# EAGLE design jlpcb-128 (EAGLE 5.11)
ABBREV: jn6; PROJECT: JeeNode v6
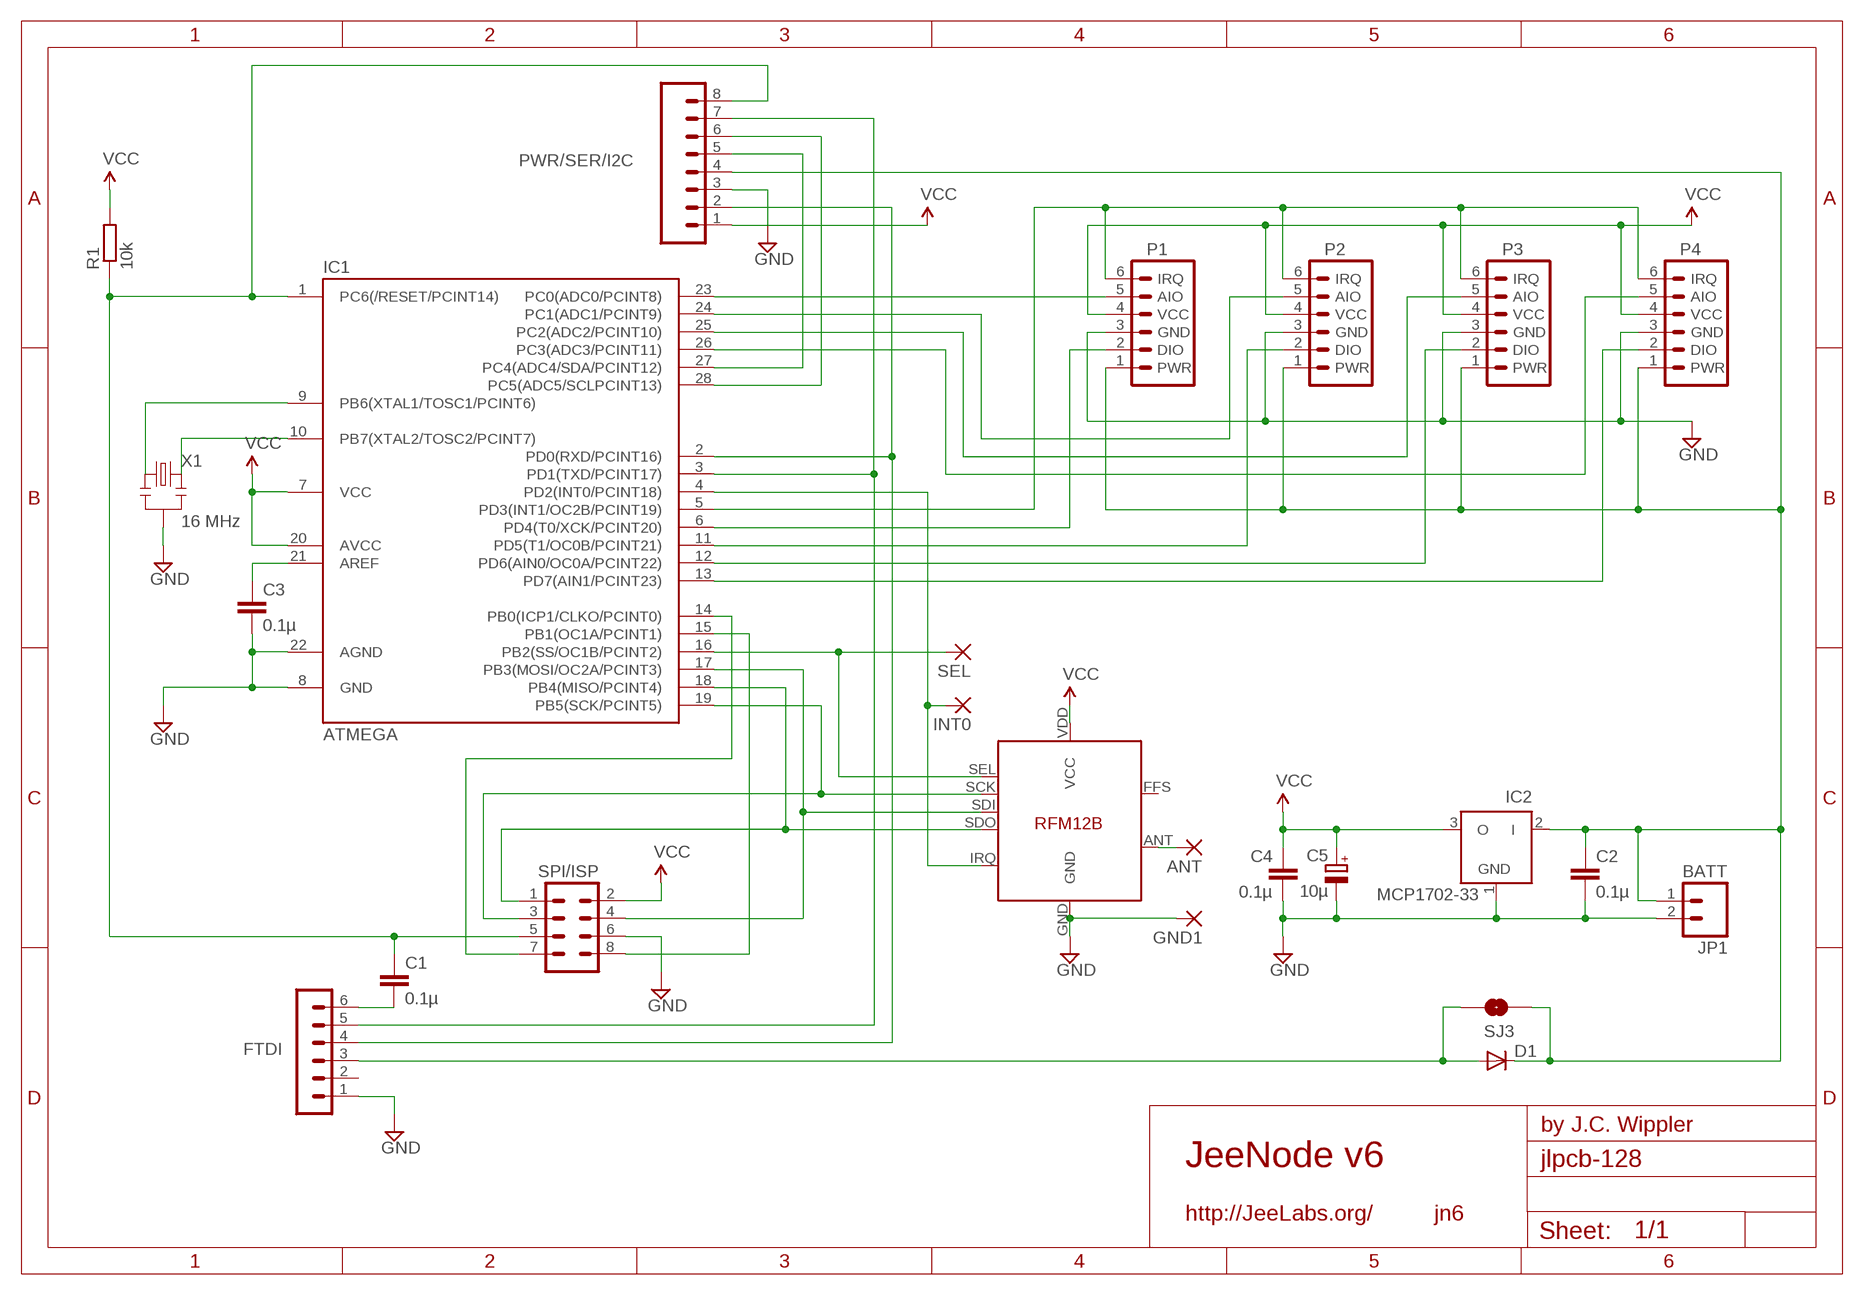
[diagram p0: schematic, sheet 1]

## Parts
ANT  1,6/0,8  [1,6/0,8]
C1  0.1µ  C-EU025-024X044  [C025-024X044]
C2  0.1µ  C-EU025-024X044  [C025-024X044]
C3  0.1µ  C-EU025-024X044  [C025-024X044]
C4  0.1µ  C-EU025-024X044  [C025-024X044]
C5  10µ  CPOL-EUE1.8-4  [E1,8-4]
D1  DIODE-D-5  [D-5]
FTDI  FTDI  MA06-1  [MA06-1]
GND1  1,6/0,8  [1,6/0,8]
IC1  ATMEGA  ATMEGA48/88/168-PU  [DIL28-3]
IC2  MCP1702-33  MCP1702Z  [TO92]
INT0  1,6/0,8  [1,6/0,8]
JP1  BATT  M02LOCK_LONGPADS  [1X02_LOCK_LONGPADS]
P1  JEEPORT  JEEPORT-FEMALE  [1X06_FEMALE_LOCK.010]
P2  JEEPORT  JEEPORT-FEMALE  [1X06_FEMALE_LOCK.010]
P3  JEEPORT  JEEPORT-FEMALE  [1X06_FEMALE_LOCK.010]
P4  JEEPORT  JEEPORT-FEMALE  [1X06_FEMALE_LOCK.010]
PWR/SER/I2C  M08  [1X08]
R1  10k  R-EU_0204/7  [0204/7]
SEL  1,6/0,8  [1,6/0,8]
SJ3  SOLDERJUMPERTRACE  [SJ_2S-TRACE]
SV7  SPI/ISP  MA04-2  [MA04-2]
U$1  RFM12B  [RFM12B]
X1  16 MHz  RESONATORPTH  [RESONATOR-PTH]

## Nets
A0: IC1.23(PC0(ADC0/PCINT8)) P1.5(AIO)
A1: IC1.24(PC1(ADC1/PCINT9)) P2.5(AIO)
A2: IC1.25(PC2(ADC2/PCINT10)) P3.5(AIO)
A3: IC1.26(PC3(ADC3/PCINT11)) P4.5(AIO)
GND [power]: C2.2 C3.2 C4.2 C5.- FTDI.1 GND1.1(P) IC1.8(GND) IC1.22(AGND) IC2.1(GND) JP1.2 P1.3(GND) P2.3(GND) P3.3(GND) P4.3(GND) PWR/SER/I2C.3 SV7.6 U$1.GND X1.2
INT2: IC1.5(PD3(INT1/OC2B/PCINT19)) P1.6(IRQ) P2.6(IRQ) P3.6(IRQ) P4.6(IRQ)
N$1: IC1.9(PB6(XTAL1/TOSC1/PCINT6)) X1.1
N$2: IC1.18(PB4(MISO/PCINT4)) SV7.1 U$1.SDO
N$3: IC1.17(PB3(MOSI/OC2A/PCINT3)) SV7.4 U$1.SDI
N$4: IC1.16(PB2(SS/OC1B/PCINT2)) SEL.1(P) U$1.SEL
N$5: IC1.19(PB5(SCK/PCINT5)) SV7.3 U$1.SCK
N$6: IC1.15(PB1(OC1A/PCINT1)) SV7.8
N$7: IC1.4(PD2(INT0/PCINT18)) INT0.1(P) U$1.IRQ
N$8: IC1.6(PD4(T0/XCK/PCINT20)) P1.2(DIO)
N$9: IC1.11(PD5(T1/OC0B/PCINT21)) P2.2(DIO)
N$10: IC1.12(PD6(AIN0/OC0A/PCINT22)) P3.2(DIO)
N$11: IC1.13(PD7(AIN1/PCINT23)) P4.2(DIO)
N$12 [power]: D1.A FTDI.3 SJ3.2
N$13: ANT.1(P) U$1.ANT
N$19: C3.1 IC1.21(AREF)
N$20: C1.2 FTDI.6
N$21: IC1.10(PB7(XTAL2/TOSC2/PCINT7)) X1.3
N$22: IC1.14(PB0(ICP1/CLKO/PCINT0)) SV7.7
N$24: IC1.28(PC5(ADC5/SCLPCINT13)) PWR/SER/I2C.6
N$25: IC1.27(PC4(ADC4/SDA/PCINT12)) PWR/SER/I2C.5
PWR [power]: C2.1 D1.C IC2.2(I) JP1.1 P1.1(PWR) P2.1(PWR) P3.1(PWR) P4.1(PWR) PWR/SER/I2C.4 SJ3.1
RST: C1.1 IC1.1(PC6(/RESET/PCINT14)) PWR/SER/I2C.8 R1.1 SV7.5
RXD: FTDI.4 IC1.2(PD0(RXD/PCINT16)) PWR/SER/I2C.2
TXD: FTDI.5 IC1.3(PD1(TXD/PCINT17)) PWR/SER/I2C.7
VCC [power]: C4.1 C5.+ IC1.7(VCC) IC1.20(AVCC) IC2.3(O) P1.4(VCC) P2.4(VCC) P3.4(VCC) P4.4(VCC) PWR/SER/I2C.1 R1.2 SV7.2 U$1.VDD(VCC)
Unconnected: FTDI.2 U$1.FFS

## Library data of the parts
ANT GND1 INT0 SEL = JeeLabs:1,6/0,8: THROUGH-HOLE PAD
C1-C4 = resistor:C-EU: CAPACITOR, European symbol
C5 = resistor:CPOL-EU: POLARIZED CAPACITOR, European symbol
D1 = diode:DIODE-: DIODE
FTDI = JeeLabs:MA06-1: PIN HEADER
IC1 = atmega8:ATMEGA48/88/168-PU
IC2 = JeeLabs:MCP1702: 200 mA, Low Power Low Dropout Voltage Regulator
JP1 = SparkFun:M02: Header 2 Standard 2-pin 0.1" header. Use with straight break away headers (SKU : PRT-00116), right angle break away headers (PRT-00553), swiss pins (PRT-00743), machine pins (PRT-00117), and female headers (PRT-00115). Molex polarized connector foot print use with SKU : PRT-08233 with associated crimp pins and housings.
P1-P4 = JeeLabs:JEEPORT: PIN HEADER
PWR/SER/I2C = SparkFun:M08: Header 8 Standard 8-pin 0.1" header. Use with straight break away headers (SKU : PRT-00116), right angle break away headers (PRT-00553), swiss pins (PRT-00743), machine pins (PRT-00117), and female headers (PRT-00115).
R1 = resistor:R-EU_: RESISTOR, European symbol
SJ3 = SparkFun:SOLDERJUMPER: Solder Jumper Standard SMD solder jumper. Used to automate production. Two varients : Normally Open and Normally Closed are the same, but have different paste layers. NC will have a large amount of paste and should jumper during reflow.
SV7 = JeeLabs:MA04-2: PIN HEADER
U$1 = JeeLabs:RFM12B
X1 = SparkFun:RESONATOR: Resonator Small SMD resonator. This is the itty bitty 10/20MHz resonators with built in caps. CSTCE10M0G55 and CSTCE20M0V53. Footprint has been reviewed closely but hasn't been tested yet.

## Net classes
1 power: width 0.381 mm, clearance 0.254 mm

## Board
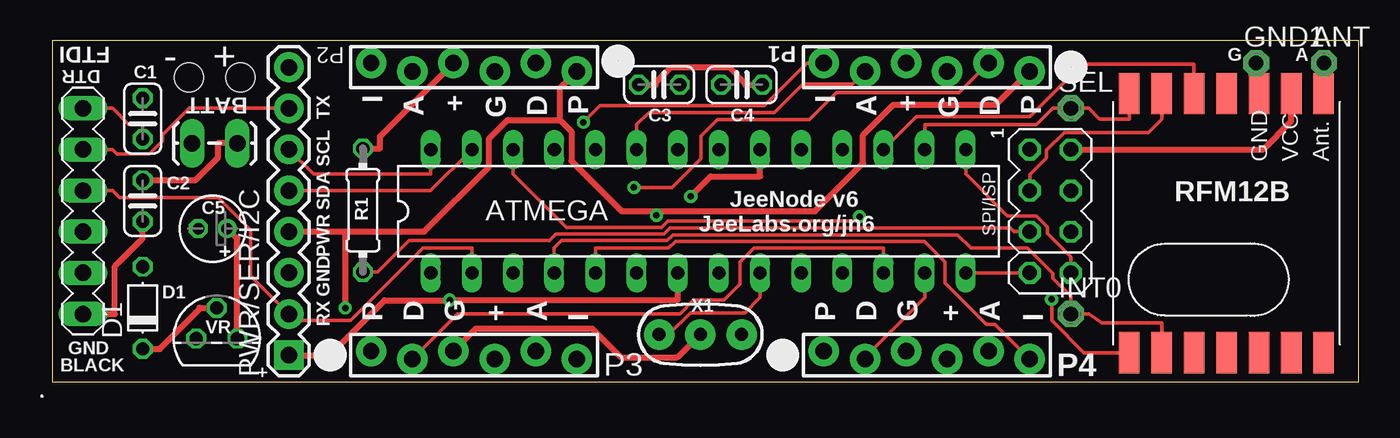
[diagram p1: board, top side]
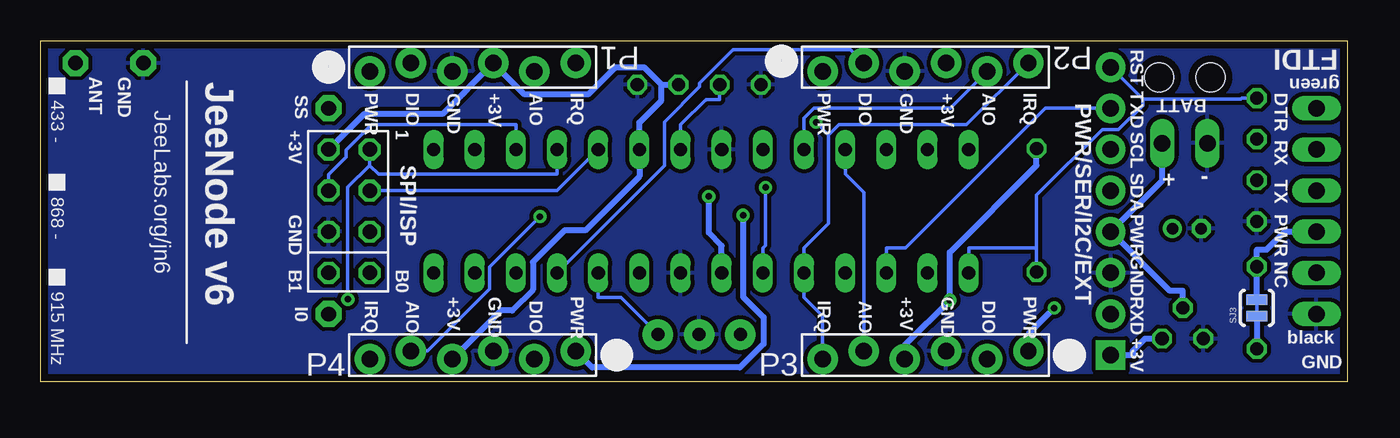
[diagram p2: board, bottom side, seen from below]

Size 80.64 x 21.08 mm. Coordinates in mm from the lower left corner, seen from the top.
Outline: 0,0 80.64,0 80.64,21.08 0,21.08 0,0
Copper layers (1*16): Top 0.035mm / dielectric 1.5mm / Bottom 0.035mm
Design rules "10mils *": minimum track width 8mil, minimum drill 0.4mm, track to track 8mil, track to pad 8mil, pad to pad 8mil, via to via 8mil, smd to smd 8mil, copper to edge 18mil, drill to drill 0.4mm, minimum pad ring 0.15mm, minimum via ring 8mil, stop-mask expansion 4mil, vias tented up to drill 20mil, thermal gap 10mil
Holes 1.78 mm at 8.45,18.8 11.62,18.8

### Footprints (pad centres in the part's own frame; a part is rotated, then mirrored left to right if it is on the bottom)
1,6/0,8 = drill 0.9 pad 1.6 octagon: 1 0,0
C025-024X044 = drill 0.813 octagon: 1 -1.27,0; 2 1.27,0
E1,8-4 = drill 0.711 pad 1.168 round: + -0.889,0 | drill 0.711 pad 1.168 octagon: - 0.889,0
D-5 = drill 0.813 octagon: A 2.54,0; C -2.54,0
MA06-1 = drill 1.016 long: 1 0,0; 2 2.54,0; 3 5.08,0; 4 7.62,0; 5 10.16,0; 6 12.7,0
DIL28-3 = drill 0.813 long: 1 -16.51,-3.81; 2 -13.97,-3.81; 3 -11.43,-3.81; 4 -8.89,-3.81; 5 -6.35,-3.81; 6 -3.81,-3.81; 7 -1.27,-3.81; 8 1.27,-3.81; 9 3.81,-3.81; 10 6.35,-3.81; 11 8.89,-3.81; 12 11.43,-3.81; 13 13.97,-3.81; 14 16.51,-3.81; 15 16.51,3.81; 16 13.97,3.81; 17 11.43,3.81; 18 8.89,3.81; 19 6.35,3.81; 20 3.81,3.81; 21 1.27,3.81; 22 -1.27,3.81; 23 -3.81,3.81; 24 -6.35,3.81; 25 -8.89,3.81; 26 -11.43,3.81; 27 -13.97,3.81; 28 -16.51,3.81
TO92 = drill 0.813 octagon: 1 -1.27,0; 2 0,1.905; 3 1.27,0
1X02_LOCK_LONGPADS = drill 1.016 long: 1 -0.127,0; 2 2.667,0
1X06_FEMALE_LOCK.010 = drill 1.016 pad 1.88 round: 1 0,0.254; 2 2.54,-0.254; 3 5.08,0.254; 4 7.62,-0.254; 5 10.16,0.254; 6 12.7,-0.254
1X08 = drill 1.016 pad 1.829 square: 1 0,0 | drill 1.016 pad 1.829 round: 2 2.54,0; 3 5.08,0; 4 7.62,0; 5 10.16,0; 6 12.7,0; 7 15.24,0; 8 17.78,0
0204/7 = drill 0.813 octagon: 1 -3.81,0; 2 3.81,0
SJ_2S-TRACE = smd 0.635 x 1.27: 1 -0.508,0; 2 0.508,0
MA04-2 = drill 0.9 octagon: 1 -3.81,-1.27; 2 -3.81,1.27; 3 -1.27,-1.27; 4 -1.27,1.27; 5 1.27,-1.27; 6 1.27,1.27; 7 3.81,-1.27; 8 3.81,1.27
RFM12B = smd 2.54 x 1.27: ANT 8,-6; FFS -8,2; GND 8,-2; IRQ -8,4; P$8 -8,0; P$9 -8,-2; P$10 -8,-4; P$12 -8,-6; P$16 8,0; SCK 8,4; SDI 8,2; SDO -8,6; SEL 8,6; VDD 8,-4
RESONATOR-PTH = drill 0.8 pad 1.88 round: 1 -2.54,0; 2 0,0; 3 2.54,0

### Placement (x,y rotation side)
ANT  78.49,19.69 0 top
C1  5.59,16.26 270 top
C2  5.59,11.18 270 top
C3  37.47,18.35 180 top
C4  42.55,18.35 0 top
C5  9.91,9.46 180 top
D1  5.59,4.57 90 top
FTDI  1.91,4.19 90 top
GND1  74.3,19.69 0 top
IC1  39.88,10.54 0 top
IC2  10.16,2.67 0 top
INT0  62.87,4.19 0 top
JP1  11.3,14.73 180 top
P1  60.33,19.43 180 top
P2  32.39,19.43 180 top
P3  19.68,1.65 0 top
P4  47.62,1.65 0 top
PWR/SER/I2C  14.61,1.65 90 top
R1  19.18,10.6 90 top
SEL  62.87,16.89 0 top
SJ3  5.59,4.57 90 bottom
SV7  61.59,10.54 270 top
U$1  72.47,9.8 90 top
X1  40.01,2.92 0 top

### Tracks (layer width: path | path; a pad name or v marks a point on that pad's centre or on a via)
A0
  Top 0.203: P1.5 49.38,18.39 46.33,18.39 44.57,16.63 36.83,16.63 36.07,15.88 IC1.23
A1
  Bottom 0.203: P2.5 24.49,16.91 32.91,16.91 33.53,16.3 33.53,15.88 IC1.24
A2
  Bottom 0.203: IC1.25 30.99,12.83 29.84,11.68 P3.5
A3  (via drill 0.4 pad 0.81)
  Top 0.203: v49.82,10.2 49.56,9.93 38,9.93 37.6,9.53 31.75,9.53 28.45,12.83 IC1.26
  Bottom 0.203: P4.5 56.77,1.91 52.93,5.74 52.93,7.09 v49.82,10.2
GND
  Top 0.381: C4.2 42.76,18.35 42.76,18.46 41.8,19.43 38.19,19.43 37.25,18.48 37.25,18.35 C3.2 | X1.2 38.6,1.52 35.11,1.52 33.33,3.3 26.16,3.3 P3.3 | C2.2 5.59,8.85 3.87,7.14 3.87,4.19 FTDI.1 | U$1.GND 74.47,19.52 74.46,19.52 GND1.1
  pour Bottom: 0,21.08 80.64,21.08 80.64,0 0,0
INT2  (via drill 0.4 pad 0.81)
  Top 0.203: v32.79,16.04 33.82,17.07 43.95,17.07 46.57,19.69 P1.6 | P4.6 58.17,3.55 57.66,3.55 55.08,6.12 55.08,7.4 53.82,8.66 38.46,8.66 38.05,8.26 33.53,8.26 IC1.5
  Bottom 0.203: 32.01,15.25 32.01,9.77 33.53,8.26 IC1.5 33.53,6.27 33.53,5.21 32.39,4.06 P3.6 | P2.6 23.49,15.88 31.39,15.88 32.01,15.25 | 32.01,15.25 v32.79,16.04
N$1
  Top 0.203: IC1.9 43.69,5.21 42.74,4.26 39.38,4.26 38.04,2.92 X1.1
N$2  (via drill 0.4 pad 0.81)
  Top 0.203: U$1.SDO 63.66,1.8 61.68,3.79 v61.68,5.1
  Bottom 0.203: v61.68,5.1 61.68,12.02 60.33,13.37 | 60.33,13.37 59.78,12.83 48.77,12.83 IC1.18 | 60.33,13.37 SV7.1
N$3
  Top 0.203: U$1.SDI 70.47,19.63 63.58,19.63 60.34,16.39 53.35,16.39 IC1.17
  Bottom 0.203: SV7.4 62.87,12.79 61.77,13.88 61.77,14.3 60.2,15.88 51.31,15.88 IC1.17
N$4
  Top 0.203: U$1.SEL 66.47,16.23 64.63,16.23 63.97,16.89 SEL.1 61.76,16.89 60.74,15.88 53.85,15.88 IC1.16
N$5
  Top 0.203: SV7.3 60.33,12.79 61.36,13.83 61.36,14.31 62.46,15.4 67.64,15.4 68.47,16.23 U$1.SCK
  Bottom 0.203: SV7.3 48.77,11.81 IC1.19
N$6
  Top 0.203: IC1.15 56.39,12.83 58.96,10.25 60.73,10.25 61.43,9.56 61.43,9.15 62.87,7.71 SV7.8
N$7
  Top 0.203: U$1.IRQ 68.47,3.63 64.78,3.63 63.97,4.19 INT0.1 62.87,5.3 61.76,6.4 61.76,6.69 60.2,8.26 56.7,8.26 55.87,9.08 38.3,9.08 37.94,8.72 31.45,8.72 30.99,8.26 IC1.4
N$8  (via drill 0.4 pad 0.81)
  Top 0.203: P1.2 55.96,17.86 48.39,17.86 46.72,16.19 41.07,16.19 40.05,15.18 40.05,13.8 38.26,12.01 v35.9,12.01
  Bottom 0.203: IC1.6 36.07,8.26 35.9,8.42 v35.9,12.01
N$9
  Bottom 0.203: P2.2 30.67,20.51 37.9,20.51 39.97,18.44 39.97,18.23 42.15,16.05 42.15,13.35 IC1.11
N$10
  Top 0.203: IC1.12 51.31,8.26 43.31,8.26 42.45,7.4 42.45,6.04 41.46,5.05 39.59,5.05 38.75,4.21 25.03,4.21 P3.2
N$11
  Top 0.203: IC1.13 53.85,5.21 50.16,1.52 P4.2
N$12
  Bottom 0.381: SJ3.2 D1.A 5.59,8.17 4.98,8.17 3.87,9.27 FTDI.3
N$13
  Top 0.203: U$1.ANT 78.47,19.38 78.49,19.4 ANT.1
N$14
  Top 0.005: -0.61,-0.94 arc10 -0.61,-0.93 | -0.61,-0.93 -0.59,-0.95 | -0.59,-0.95 -0.57,-0.94 | -0.57,-0.94 -0.59,-0.92 | -0.59,-0.92 arc19 -0.58,-0.9 | -0.58,-0.9 -0.56,-0.9 | -0.56,-0.9 -0.56,-0.88 | -0.56,-0.88 -0.58,-0.88 | -0.58,-0.88 arc19 -0.59,-0.86 | -0.59,-0.86 -0.57,-0.84 | -0.57,-0.84 -0.59,-0.83 | -0.59,-0.83 -0.61,-0.84 | -0.61,-0.84 arc19 -0.62,-0.84 | -0.62,-0.84 -0.63,-0.81 | -0.63,-0.81 -0.64,-0.81 | -0.64,-0.81 -0.65,-0.84 | -0.66,-0.84 arc-19 -0.65,-0.84 | -0.68,-0.83 -0.66,-0.84 | -0.7,-0.84 -0.68,-0.83 | -0.68,-0.86 -0.7,-0.84 | -0.69,-0.88 arc-19 -0.68,-0.86 | -0.71,-0.88 -0.69,-0.88 | -0.71,-0.9 -0.71,-0.88 | -0.69,-0.9 -0.71,-0.9 | -0.68,-0.92 arc-19 -0.69,-0.9 | -0.7,-0.94 -0.68,-0.92 | -0.68,-0.95 -0.7,-0.94 | -0.66,-0.93 -0.68,-0.95 | -0.66,-0.94 arc-10 -0.66,-0.93 | -0.64,-0.91 -0.66,-0.94 | -0.66,-0.89 arc68 -0.64,-0.91 | -0.63,-0.91 arc248 -0.66,-0.89 | -0.61,-0.94 -0.63,-0.91 | -0.61,-0.94 arc10 -0.61,-0.93 | -0.61,-0.93 -0.59,-0.95 | -0.59,-0.95 -0.57,-0.94 | -0.57,-0.94 -0.59,-0.92 | -0.59,-0.92 arc19 -0.58,-0.9 | -0.58,-0.9 -0.56,-0.9 | -0.56,-0.9 -0.56,-0.88 | -0.56,-0.88 -0.58,-0.88 | -0.58,-0.88 arc19 -0.59,-0.86 | -0.59,-0.86 -0.57,-0.84 | -0.57,-0.84 -0.59,-0.83 | -0.59,-0.83 -0.61,-0.84 | -0.61,-0.84 arc19 -0.62,-0.84 | -0.62,-0.84 -0.63,-0.81 | -0.63,-0.81 -0.64,-0.81 | -0.64,-0.81 -0.65,-0.84 | -0.66,-0.84 arc-19 -0.65,-0.84 | -0.68,-0.83 -0.66,-0.84 | -0.7,-0.84 -0.68,-0.83 | -0.68,-0.86 -0.7,-0.84 | -0.69,-0.88 arc-19 -0.68,-0.86 | -0.71,-0.88 -0.69,-0.88 | -0.71,-0.9 -0.71,-0.88 | -0.69,-0.9 -0.71,-0.9 | -0.68,-0.92 arc-19 -0.69,-0.9 | -0.7,-0.94 -0.68,-0.92 | -0.68,-0.95 -0.7,-0.94 | -0.66,-0.93 -0.68,-0.95 | -0.66,-0.94 arc-10 -0.66,-0.93
  Top 0.005: -0.64,-0.91 -0.66,-0.94 | -0.66,-0.89 arc68 -0.64,-0.91 | -0.63,-0.91 arc248 -0.66,-0.89 | -0.61,-0.94 -0.63,-0.91 | -0.61,-0.94 arc10 -0.61,-0.93 | -0.61,-0.93 -0.59,-0.95 | -0.59,-0.95 -0.57,-0.94 | -0.57,-0.94 -0.59,-0.92 | -0.59,-0.92 arc19 -0.58,-0.9 | -0.58,-0.9 -0.56,-0.9 | -0.56,-0.9 -0.56,-0.88 | -0.56,-0.88 -0.58,-0.88 | -0.58,-0.88 arc19 -0.59,-0.86 | -0.59,-0.86 -0.57,-0.84 | -0.57,-0.84 -0.59,-0.83 | -0.59,-0.83 -0.61,-0.84 | -0.61,-0.84 arc19 -0.62,-0.84 | -0.62,-0.84 -0.63,-0.81 | -0.63,-0.81 -0.64,-0.81 | -0.64,-0.81 -0.65,-0.84 | -0.66,-0.84 arc-19 -0.65,-0.84 | -0.68,-0.83 -0.66,-0.84 | -0.7,-0.84 -0.68,-0.83 | -0.68,-0.86 -0.7,-0.84 | -0.69,-0.88 arc-19 -0.68,-0.86 | -0.71,-0.88 -0.69,-0.88 | -0.71,-0.9 -0.71,-0.88 | -0.69,-0.9 -0.71,-0.9 | -0.68,-0.92 arc-19 -0.69,-0.9 | -0.7,-0.94 -0.68,-0.92 | -0.68,-0.95 -0.7,-0.94 | -0.66,-0.93 -0.68,-0.95 | -0.66,-0.94 arc-10 -0.66,-0.93 | -0.64,-0.91 -0.66,-0.94 | -0.66,-0.89 arc68 -0.64,-0.91 | -0.63,-0.91 arc248 -0.66,-0.89 | -0.61,-0.94 -0.63,-0.91
N$19
  Bottom 0.203: C3.1 38.73,17.44 39.59,17.44 41.15,15.88 IC1.21
N$20
  Top 0.203: C1.2 5.59,15.9 4.72,15.9 3.73,16.89 FTDI.6
N$21
  Bottom 0.203: IC1.10 46.23,5.21 44.83,5.21 X1.3
N$22
  Top 0.203: IC1.14 SV7.7
N$24
  Top 0.203: IC1.28 23.37,12.83 16.13,12.83 PWR/SER/I2C.6
N$25
  Top 0.203: PWR/SER/I2C.5 23.37,11.81 IC1.27
PWR  (via drill 0.4 pad 0.81)
  Top 0.381: 31.34,16.17 31.34,18.13 P2.1 | 37.28,10.54 35.14,10.54 32.05,13.64 32.05,15.46 31.34,16.17 | 18.08,9.27 22.96,9.27 26.96,13.27 26.96,15.02 28.12,16.17 31.34,16.17 | P1.1 58.25,17.11 51.91,17.11 50.04,15.23 50.04,13.5 47.08,10.54 37.28,10.54 | 37.28,10.54 v37.28,10.29 | 18.08,9.27 v18.08,4.56 | PWR/SER/I2C.4 18.08,9.27 | IC2.2 9.11,4.57 9.11,4.5 6.64,2.03 D1.C | JP1.1 10.22,14.73 10.22,13.83 8.84,12.45 C2.1
  Bottom 0.381: v37.28,10.29 37.28,5.24 36.03,3.98 36.03,2.34 37.49,0.89 46.61,0.89 P4.1 | IC2.2 10.16,5.63 10.96,5.63 PWR/SER/I2C.4 11.43,12.45 JP1.1 | v18.08,4.56 19.68,2.96 P3.1 | SJ3.1 D1.C
RST
  Top 0.203: R1.1 20.09,6.79 22.02,8.73 30.7,8.73 31.1,9.12 37.77,9.12 38.14,9.49 59.12,9.49 59.34,9.27 SV7.5
  Bottom 0.203: 19.18,8.26 19.18,11.53 15.13,15.57 14.13,15.57 12.63,17.07 12.63,17.46 | 19.18,8.26 R1.1 | 19.18,8.26 23.37,8.26 IC1.1 | 12.63,17.46 6.57,17.46 6.5,17.53 C1.1 | 12.63,17.46 PWR/SER/I2C.8
RXD
  Top 0.203: IC1.2 25.91,8.26 22.88,8.26 18.42,3.79 15.01,3.79 PWR/SER/I2C.2 12.26,6.54 12.26,9.37 10.25,11.37 4.18,11.37 3.73,11.81 FTDI.4
TXD
  Top 0.203: FTDI.5 3.73,14.35 4.03,14.06 6,14.06 6.83,14.9 6.83,15.27 8.45,16.89 PWR/SER/I2C.7
  Bottom 0.203: IC1.3 28.45,8.26 27.27,8.26 18.63,16.89 PWR/SER/I2C.7
VCC  (via drill 0.4 pad 0.81)
  Top 0.381: PWR/SER/I2C.1 17.12,1.65 20.51,5.04 v24.54,5.04 24.56,5.07 38.61,5.07 IC1.7 | IC1.20 43.69,12.69 40.64,12.69 v39.41,11.46 | R1.2 20.23,14.41 20.23,15.15 P2.4 | IC2.3 11.43,8.83 C5.+ | U$1.VDD 76.47,16.09 74.73,14.35 SV7.2
  Bottom 0.381: P3.4 27.3,2.28 v24.54,5.04 24.54,8 19.18,13.36 R1.2 | SV7.2 60.67,16.54 55.85,16.54 P1.4 50.77,17.75 46.86,17.75 45.19,19.42 43.39,19.42 42.32,18.35 | IC1.7 38.61,8.4 39.41,9.2 v39.41,11.46 | P4.4 52.24,4.4 51.54,4.4 50.25,5.68 50.25,7.4 48.3,9.35 47.02,9.35 43.69,12.69 IC1.20 43.69,16.02 42.33,17.37 42.33,18.35 42.32,18.35 | 42.32,18.35 C4.1 | PWR/SER/I2C.1 13.25,1.65 13.25,1.91 12.48,2.67 IC2.3

### Text on the board
_tsilk: FTDI | P1 | G | A | DTR | C1 | - | + | TX | I | A | + | G | D | P | I | A | + | G | D | P | C3 | C4 | SCL | 1 | SDA | C2 | JeeNode v6 | RFM12B | C5 | PWR | R1 | JeeLabs.org/jn6 | GND | D1 | RX | P | D | G | + | A | I | X1 | P | D | G | + | A | I | VR | GND | BLACK | + | P4
_bsilk: P2 | P1 | FTDI | RST | green | GND | ANT | DTR | TXD | IRQ | AIO | +3V | GND | DIO | PWR | IRQ | AIO | +3V | GND | DIO | PWR | SS | JeeNode v6 | BATT | PWR/SER/I2C/EXT | JeeLabs.org/jn6 | 433 - | RX | SCL | 1 | +3V | - | + | SDA | SPI/ISP | TX | 868 - | PWR | PWR | GND | GND | NC | B0 | B1 | RXD | PWR | DIO | GND | +3V | AIO | IRQ | PWR | DIO | GND | +3V | AIO | IRQ | I0 | 915 MHz | +3V | black | GND | P3 | P4